# EAGLE design noWOL (EAGLE 7.7.0)
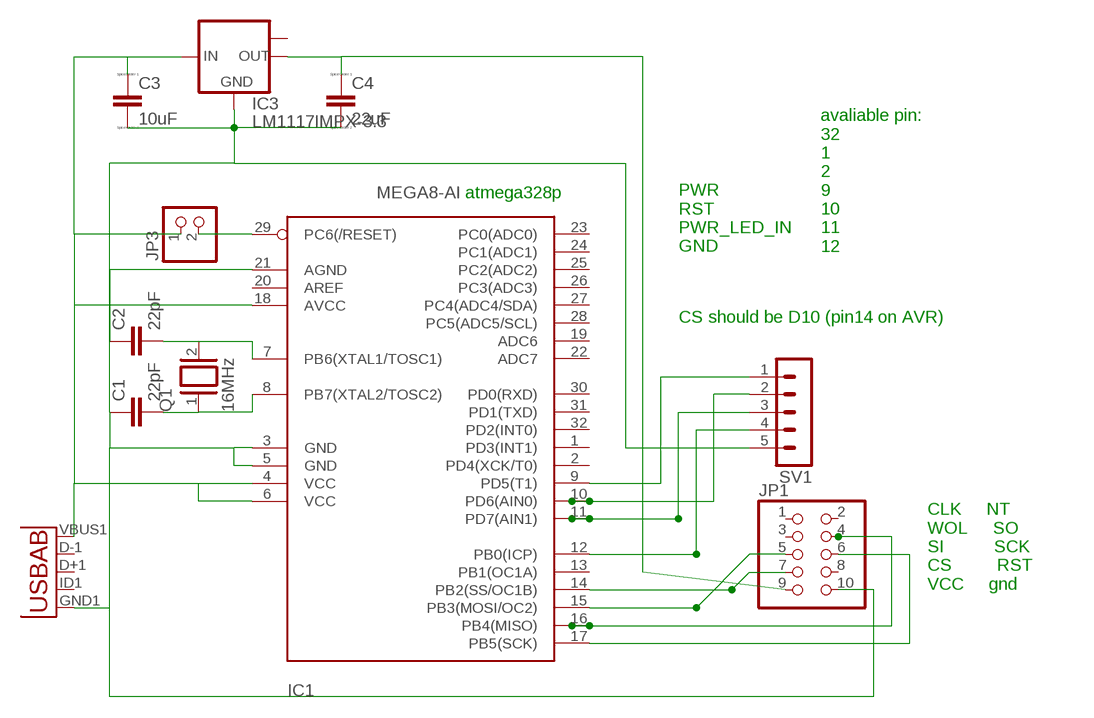
[diagram p0: schematic, sheet 1]

## Parts
C1  22pF  C-EUC0603  [C0603]
C2  22pF  C-EUC0603  [C0603]
C3  10uF  CC0603  [C0603]
C4  22uF  CC0603  [C0603]
IC1  MEGA8-AI  [TQFP32-08]
IC3  LM1117IMPX-3.3  [SOT223]
JP1  PINHD-2X5  [2X05]
JP3  PINHD-1X2  [1X02]
Q1  16MHz  XTAL/S  [QS]
SV1  MA05-1  [MA05-1]
U1  USB""  [USB-MICRO-SMD]

## Nets
N$2: C2.2 IC1.7(PB6(XTAL1/TOSC1)) Q1.2
N$3: C1.2 IC1.8(PB7(XTAL2/TOSC2)) Q1.1
N$4: IC1.29(PC6(/RESET)) JP3.2
N$5: C3.1 IC1.4(VCC) IC1.6(VCC) IC1.18(AVCC) IC3.3(IN) JP3.1 U1.VBUS1(VBUS)
N$6: IC1.16(PB4(MISO)) JP1.4
N$7: IC1.15(PB3(MOSI/OC2)) JP1.5
N$8: IC1.14(PB2(SS/OC1B)) JP1.7
N$10: IC1.17(PB5(SCK)) JP1.6
N$11: IC1.10(PD6(AIN0)) SV1.2
N$12: IC1.11(PD7(AIN1)) SV1.3
N$13: IC1.12(PB0(ICP)) SV1.4
N$15: IC1.9(PD5(T1)) SV1.1
N$16: C4.1 IC3.2(OUT) JP1.9
N$17: C1.1 C2.1 C3.2 C4.2 IC1.3(GND) IC1.5(GND) IC1.21(AGND) IC3.1(GND) JP1.10 SV1.5 U1.GND1(GND)
Unconnected: IC1.1(PD3(INT1)) IC1.2(PD4(XCK/T0)) IC1.13(PB1(OC1A)) IC1.19(ADC6) IC1.20(AREF) IC1.22(ADC7) IC1.23(PC0(ADC0)) IC1.24(PC1(ADC1)) IC1.25(PC2(ADC2)) IC1.26(PC3(ADC3)) IC1.27(PC4(ADC4/SDA)) IC1.28(PC5(ADC5/SCL)) IC1.30(PD0(RXD)) IC1.31(PD1(TXD)) IC1.32(PD2(INT0)) IC3.TAB(OUT1) JP1.1 JP1.2 JP1.3 JP1.8 U1.D+1(D+) U1.D-1(D-) U1.ID1(USBID)

## Notes on the sheet
- atmega328p
- PWR
  RST
  PWR_LED_IN
  GND
- avaliable pin:
  32
  1
  2
  9
  10
  11
  12
- CS should be D10 (pin14 on AVR)
- CLK     NT
  WOL     SO
  SI          SCK
  CS         RST 
  VCC     gnd

## Library data of the parts
C1 C2 = resistor:C-EU: CAPACITOR, European symbol
C3 C4 = eagle-ltspice:C: CAPACITOR, European symbol; SPICEMODEL: NONE; SPICEPREFIX: C
IC1 = avr-6:MEGA8: MICROCONTROLLER 8 Kbytes FLASH 1 kbytes SRAM 512 bytes EEPROM USART 6-channel 10 bit ADC 2-channel 8 bit ADC
IC3 = lm1117:LM1117IMPX-*
JP1 = pinhead:PINHD-2X5: PIN HEADER
JP3 = pinhead:PINHD-1X2: PIN HEADER
Q1 = special:XTAL/S: CRYSTAL
SV1 = con-lstb:MA05-1: PIN HEADER; OC_FARNELL: unknown; OC_NEWARK: unknown
U1 = MicroUSB:USB: This is a USB AB connector that is compatible with USB OTG. i.e. this connector can serve as a host or device

## Board
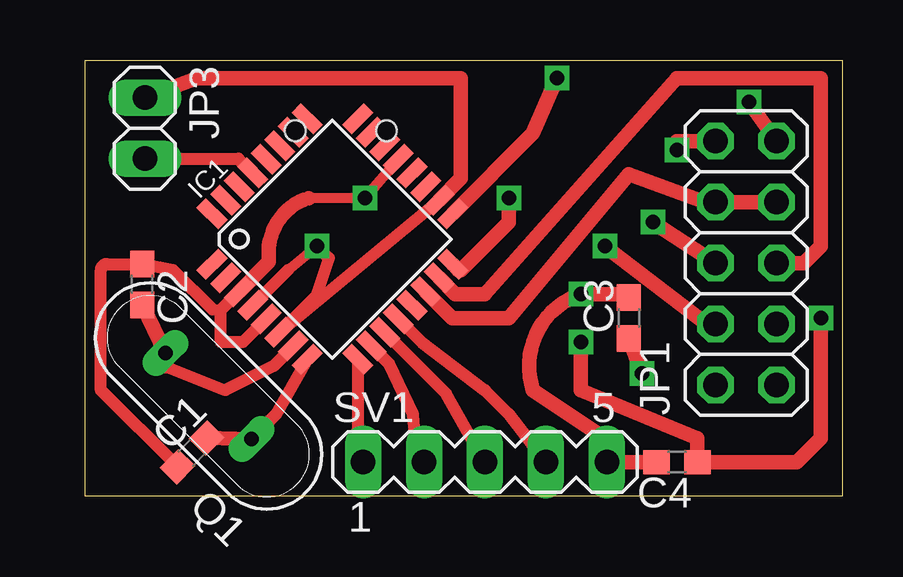
[diagram p1: board, top side]
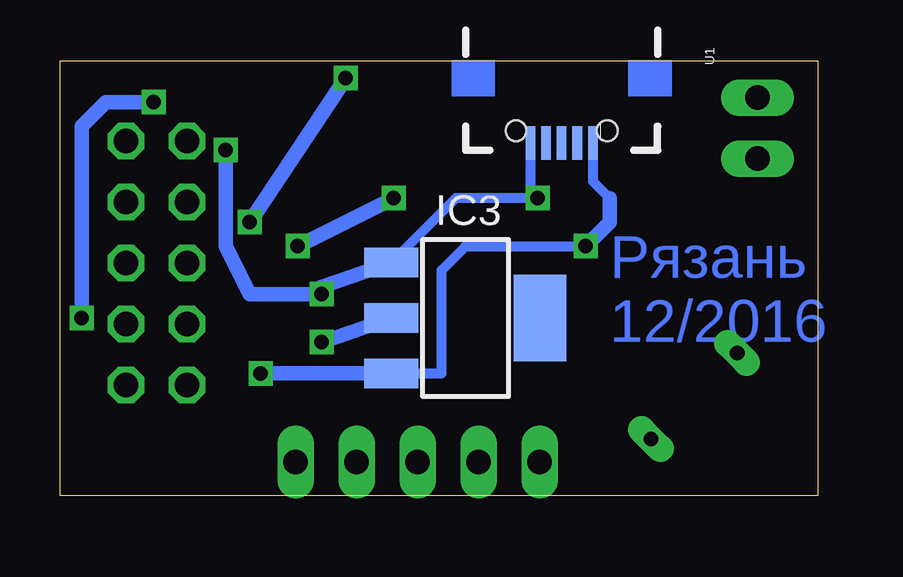
[diagram p2: board, bottom side, seen from below]

Size 31.58 x 18.12 mm. Coordinates in mm from the lower left corner, seen from the top.
Outline: 0,0 31.58,0 31.58,18.12 0,18.12 0,0
Copper layers (1*16): Top 0.035mm / dielectric 1.5mm / Bottom 0.035mm
Design rules "default": minimum track width 10mil, minimum drill 24mil, track to track 8mil, track to pad 8mil, pad to pad 8mil, via to via 8mil, smd to smd 8mil, copper to edge 40mil, drill to drill 8mil, minimum pad ring 10mil, minimum via ring 8mil, stop-mask expansion 4mil, vias tented up to drill 0mil, thermal gap 10mil

### Footprints (pad centres in the part's own frame; a part is rotated, then mirrored left to right if it is on the bottom)
C0603 = smd 1.1 x 1: 1 -0.85,0; 2 0.85,0
TQFP32-08 = smd 1.27 x 0.559: 1 -4.293,2.8; 2 -4.293,2; 3 -4.293,1.2; 4 -4.293,0.4; 5 -4.293,-0.4; 6 -4.293,-1.2; 7 -4.293,-2; 8 -4.293,-2.8; 17 4.293,-2.8; 18 4.293,-2; 19 4.293,-1.2; 20 4.293,-0.4; 21 4.293,0.4; 22 4.293,1.2; 23 4.293,2; 24 4.293,2.8 | smd 0.559 x 1.27: 9 -2.8,-4.293; 10 -2,-4.293; 11 -1.2,-4.293; 12 -0.4,-4.293; 13 0.4,-4.293; 14 1.2,-4.293; 15 2,-4.293; 16 2.8,-4.293; 25 2.8,4.293; 26 2,4.293; 27 1.2,4.293; 28 0.4,4.293; 29 -0.4,4.293; 30 -1.2,4.293; 31 -2,4.293; 32 -2.8,4.293
SOT223 = smd 1.219 x 2.235: 1 -2.311,-3.099; 2 0,-3.099; 3 2.311,-3.099 | smd 3.6 x 2.2: TAB 0,3.099
2X05 = drill 1.016 octagon: 1 -5.08,-1.27; 2 -5.08,1.27; 3 -2.54,-1.27; 4 -2.54,1.27; 5 0,-1.27; 6 0,1.27; 7 2.54,-1.27; 8 2.54,1.27; 9 5.08,-1.27; 10 5.08,1.27
1X02 = drill 1.016 long: 1 -1.27,0; 2 1.27,0
QS = drill 0.61 long: 1 -2.54,0; 2 2.54,0
MA05-1 = drill 1.016 long: 1 -5.08,0; 2 -2.54,0; 3 0,0; 4 2.54,0; 5 5.08,0
USB-MICRO-SMD = smd 1.4 x 0.4: D+1 2.7,0; D-1 2.7,0.65; GND1 2.7,-1.3; ID1 2.7,-0.65; VBUS1 2.7,1.3 | hole 0.85: 2.2,1.9; 2.2,-1.9

### Placement (x,y rotation side)
C1  4.47,1.81 45 top
C2  2.39,8.81 270 top
C3  22.68,7.41 90 top
C4  24.68,1.41 180 top
IC1  10.32,10.7 45 top
IC3  14.68,7.41 270 bottom
JP1  27.56,9.7 90 top
JP3  2.51,15.32 270 top
Q1  5.16,4.16 135 top
SV1  16.68,1.41 0 top
U1  10.68,17.41 270 bottom

### Tracks (layer width: path | path; a pad name or v marks a point on that pad's centre or on a via)
N$2
  Top 0.5: 3.36,5.41 5.86,4.41 7.86,5.41 IC1.7
  Top 0.61: 3.36,5.41 Q1.2 C2.2
N$3
  Top 0.5: Q1.1 7.96,3.38 IC1.8
  Top 0.61: Q1.1 C1.2
N$4
  Top 0.5: JP3.2 6.4,14.05 IC1.29
N$5  (via drill 0.6)
  Top 0.406: 9.68,8.41 9.68,8.36 | 8.46,9.41 v9.68,10.41
  Top 0.5: v9.68,10.41 10.18,9.91 9.68,8.41 | 9.68,8.36 IC1.6 IC1.18 | IC1.4 8.46,9.41
  Top 0.61: JP3.1 4.68,17.41 15.68,17.41 15.68,13.23 IC1.18 | C3.1 v23.22,5.1
  Bottom 0.406: IC3.3 15.68,5.1 15.68,9.41 14.68,10.41 v9.68,10.41 | U1.VBUS1 9.38,13.11 8.68,12.41
  Bottom 0.61: 8.68,12.41 8.68,11.41 v9.68,10.41 | IC3.3 v23.22,5.1
N$6  (via drill 0.6)
  Top 0.61: JP1.4 25.93,7.16 v21.68,10.41 | v17.68,12.41 17.68,11.41 15.68,9.41 15.57,9.41 IC1.16
  Bottom 0.61: v21.68,10.41 v17.68,12.41
N$7
  Top 0.61: IC1.15 15.44,8.41 16.68,8.41 24.68,17.41 30.68,17.41 30.68,10.41 29.97,9.7 JP1.5
N$8
  Top 0.61: IC1.14 15.31,7.41 17.68,7.41 22.68,13.41 25.85,12.24 JP1.7
N$10  (via drill 0.6)
  Top 0.61: JP1.6 v23.68,11.41 | v19.68,17.41 18.68,15.1 IC1.17
  Bottom 0.61: v23.68,11.41 v19.68,17.41
N$11
  Top 0.5: IC1.10 12.68,5.51 13.68,3.41 arc26 SV1.2
N$12
  Top 0.5: IC1.11 15.05,4.27 SV1.3
N$13
  Top 0.5: IC1.12 14.04,6.41 16.68,4.41 17.68,3.41 SV1.4
N$15
  Top 0.5: IC1.9 11.38,2.71 arc20 SV1.1
N$16  (via drill 0.6)
  Top 0.61: v20.68,6.41 20.68,4.41 25.53,2.41 C4.1 29.68,1.41 30.68,2.41 v30.68,7.41 | v27.68,16.41 JP1.9
  Bottom 0.61: IC3.2 v20.68,6.41 | v30.68,7.41 30.68,15.41 29.68,16.41 v27.68,16.41
N$17  (via drill 0.6)
  Top 0.406: 5.68,7.76 5.33,7.76 | 21.83,1.41 SV1.5 | 9.33,12.41 v11.68,12.41 IC1.21
  Top 0.5: IC1.3 5.68,7.76 5.68,6.41 6.6,6.41 IC1.5 | 5.33,7.76 3.68,9.41 C2.1 0.93,9.66 arc90 0.68,9.41 0.68,4.4 C1.1
  Top 0.61: IC1.3 7.68,9.76 7.68,10.41 arc-66 9.33,12.41 | C4.2 SV1.5 21.68,1.41 21.68,2.41 18.68,4.41 arc-90 v20.68,8.41 22.53,8.41 C3.2 | JP1.10 24.68,14.78 v24.68,14.41
  Bottom 0.406: U1.GND1 11.98,12.71 v11.68,12.41 15.09,12.41 IC3.1
  Bottom 0.61: IC3.1 20.68,8.72 v20.68,8.41 23.68,8.41 24.68,10.41 v24.68,14.41

### Text on the board
Bottom: Рязань / 12/2016